# EAGLE design CHRONGLER (EAGLE 9.6.2)
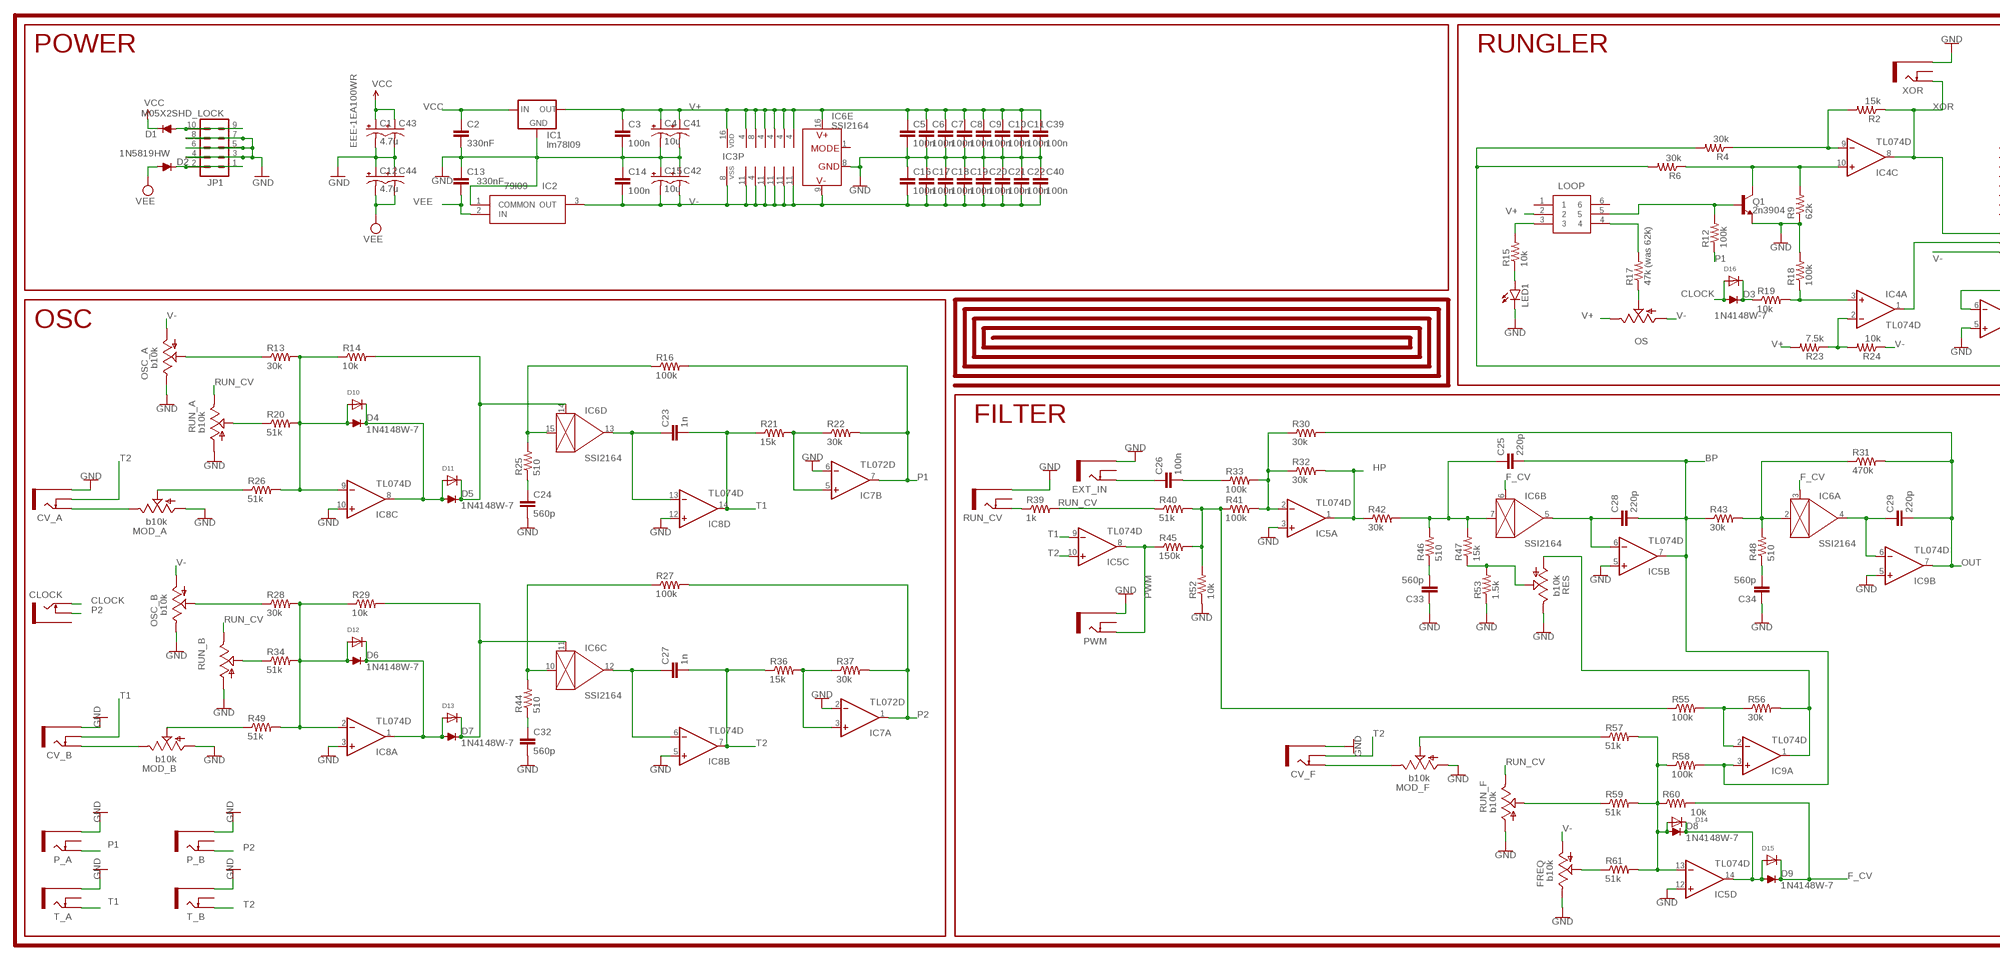
[diagram p0: schematic, sheet 1, part 1 of 2]
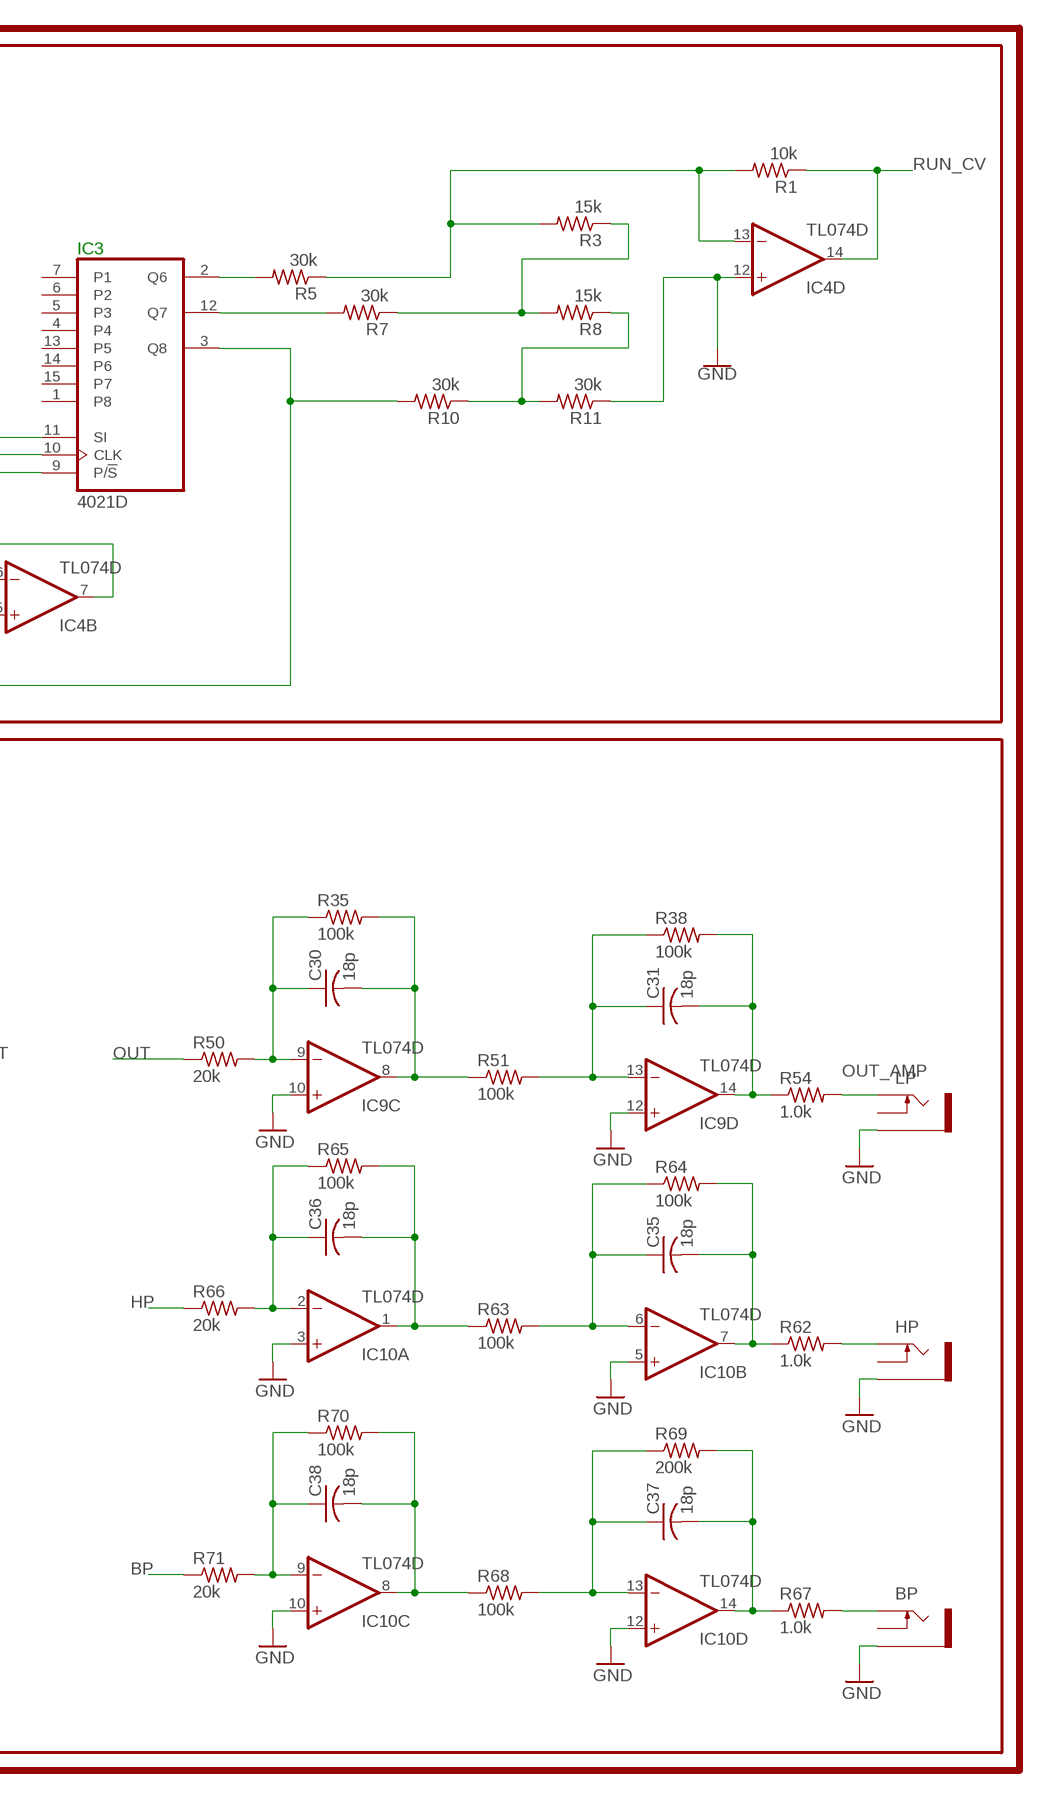
[diagram p1: schematic, sheet 1, part 2 of 2]

## Parts
BP  THONKICONNNEW  [WQP-PJ301M-12_JACK]
C1  4.7u  CPOL-USC  [PANASONIC_C]
C2  330nF  C-EUC1206  [C1206]
C3  100n  C-EUC1206  [C1206]
C4  10u  CPOL-USC  [PANASONIC_C]
C5  100n  C-EUC0603  [C0603]
C6  100n  C-EUC0603  [C0603]
C7  100n  C-EUC0603  [C0603]
C8  100n  C-EUC0603  [C0603]
C9  100n  C-EUC0603  [C0603]
C10  100n  C-EUC0603  [C0603]
C11  100n  C-EUC0603  [C0603]
C12  4.7u  CPOL-USC  [PANASONIC_C]
C13  330nF  C-EUC1206  [C1206]
C14  100n  C-EUC1206  [C1206]
C15  10u  CPOL-USC  [PANASONIC_C]
C16  100n  C-EUC0603  [C0603]
C17  100n  C-EUC0603  [C0603]
C18  100n  C-EUC0603  [C0603]
C19  100n  C-EUC0603  [C0603]
C20  100n  C-EUC0603  [C0603]
C21  100n  C-EUC0603  [C0603]
C22  100n  C-EUC0603  [C0603]
C23  1n  C-EUC0603  [C0603]
C24  560p  C-EUC0603  [C0603]
C25  220p  C-EUC0603  [C0603]
C26  100n  C-EUC0603  [C0603]
C27  1n  C-EUC0603  [C0603]
C28  220p  C-EUC0603  [C0603]
C29  220p  C-EUC0603  [C0603]
C30  18p  C-USC0603  [C0603]
C31  18p  C-USC0603  [C0603]
C32  560p  C-EUC0603  [C0603]
C33  560p  C-EUC0603  [C0603]
C34  560p  C-EUC0603  [C0603]
C35  18p  C-USC0603  [C0603]
C36  18p  C-USC0603  [C0603]
C37  18p  C-USC0603  [C0603]
C38  18p  C-USC0603  [C0603]
C39  100n  C-EUC0603  [C0603]
C40  100n  C-EUC0603  [C0603]
C41  CPOL-USE2.5-6  [E2,5-6]
C42  CPOL-USE2.5-6  [E2,5-6]
C43  CPOL-USE2.5-6  [E2,5-6]
C44  CPOL-USE2.5-6  [E2,5-6]
CLOCK  THONKICONNNEW  [WQP-PJ301M-12_JACK]
CV_A  THONKICONNNEW  [WQP-PJ301M-12_JACK]
CV_B  THONKICONNNEW  [WQP-PJ301M-12_JACK]
CV_F  THONKICONNNEW  [WQP-PJ301M-12_JACK]
D1  1N5819HW  DIODE-SOD123  [SOD123]
D2  1N5819HW  DIODE-SOD123  [SOD123]
D3  1N4148W-7  [SOD123]
D4  1N4148W-7  [SOD123]
D5  1N4148W-7  [SOD123]
D6  1N4148W-7  [SOD123]
D7  1N4148W-7  [SOD123]
D8  1N4148W-7  [SOD123]
D9  1N4148W-7  [SOD123]
D10  DIODESOD-323F  [SOD-323F]
D11  DIODESOD-323F  [SOD-323F]
D12  DIODESOD-323F  [SOD-323F]
D13  DIODESOD-323F  [SOD-323F]
D14  DIODESOD-323F  [SOD-323F]
D15  DIODESOD-323F  [SOD-323F]
D16  DIODESOD-323F  [SOD-323F]
EXT_IN  THONKICONNNEW  [WQP-PJ301M-12_JACK]
FREQ  b10k  9MM_SNAP-IN_POT_  [9MM_SNAP-IN_POT]
HP  THONKICONNNEW  [WQP-PJ301M-12_JACK]
IC1  lm78l09  78LXX-SOT89  [SOT89]
IC2  79l09  NJM79L05UA-TE1  [SOT-89-3]
IC3  4021D  [SO16]
IC4  TL074D  [SO14]
IC5  TL074D  [SO14]
IC6  SSI2164  SSM2164S  [SOIC16N]
IC7  TL072D  [SO08]
IC8  TL074D  [SO14]
IC9  TL074D  [SO14]
IC10  TL074D  [SO14]
JP1  M05X2SHD_LOCK  [2X5-SHROUDED_LOCK]
LED1  LEDLD260  [LD260]
LOOP  MHPS2266  [DIPS450W80P200L600H1050Q6N]
LP  THONKICONNNEW  [WQP-PJ301M-12_JACK]
MOD_A  b10k  9MM_SNAP-IN_POT_  [9MM_SNAP-IN_POT]
MOD_B  b10k  9MM_SNAP-IN_POT_  [9MM_SNAP-IN_POT]
MOD_F  b10k  9MM_SNAP-IN_POT_  [9MM_SNAP-IN_POT]
OS  9MM_SNAP-IN_POT_  [9MM_SNAP-IN_POT]
OSC_A  b10k  9MM_SNAP-IN_POT_  [9MM_SNAP-IN_POT]
OSC_B  b10k  9MM_SNAP-IN_POT_  [9MM_SNAP-IN_POT]
P_A  THONKICONNNEW  [WQP-PJ301M-12_JACK]
P_B  THONKICONNNEW  [WQP-PJ301M-12_JACK]
PWM  THONKICONNNEW  [WQP-PJ301M-12_JACK]
Q1  2n3904  TRANS_NPN-MMBT2222AL  [SOT23-3]
R1  10k  R-US_R0603  [R0603]
R2  15k  R-US_R0603  [R0603]
R3  15k  R-US_R0603  [R0603]
R4  30k  R-US_R0603  [R0603]
R5  30k  R-US_R0603  [R0603]
R6  30k  R-US_R0603  [R0603]
R7  30k  R-US_R0603  [R0603]
R8  15k  R-US_R0603  [R0603]
R9  62k  R-US_R0603  [R0603]
R10  30k  R-US_R0603  [R0603]
R11  30k  R-US_R0603  [R0603]
R12  100k  R-US_R0603  [R0603]
R13  30k  R-US_R0603  [R0603]
R14  10k  R-US_R0603  [R0603]
R15  10k  R-US_R0603  [R0603]
R16  100k  R-US_R0603  [R0603]
R17  47k (was 62k)  R-US_R0603  [R0603]
R18  100k  R-US_R0603  [R0603]
R19  10k  R-US_R0603  [R0603]
R20  51k  R-US_R0603  [R0603]
R21  15k  R-US_R0603  [R0603]
R22  30k  R-US_R0603  [R0603]
R23  7.5k  R-US_R0603  [R0603]
R24  10k  R-US_R0603  [R0603]
R25  510  R-US_R0603  [R0603]
R26  51k  R-US_R0603  [R0603]
R27  100k  R-US_R0603  [R0603]
R28  30k  R-US_R0603  [R0603]
R29  10k  R-US_R0603  [R0603]
R30  30k  R-US_R0603  [R0603]
R31  470k  R-US_R0603  [R0603]
R32  30k  R-US_R0603  [R0603]
R33  100k  R-US_R0603  [R0603]
R34  51k  R-US_R0603  [R0603]
R35  100k  R-US_R0603  [R0603]
R36  15k  R-US_R0603  [R0603]
R37  30k  R-US_R0603  [R0603]
R38  100k  R-US_R0603  [R0603]
R39  1k  R-US_R0603  [R0603]
R40  51k  R-US_R0603  [R0603]
R41  100k  R-US_R0603  [R0603]
R42  30k  R-US_R0603  [R0603]
R43  30k  R-US_R0603  [R0603]
R44  510  R-US_R0603  [R0603]
R45  150k  R-US_R0603  [R0603]
R46  510  R-US_R0603  [R0603]
R47  15k  R-US_R0603  [R0603]
R48  510  R-US_R0603  [R0603]
R49  51k  R-US_R0603  [R0603]
R50  20k  R-US_R0603  [R0603]
R51  100k  R-US_R0603  [R0603]
R52  10k  R-US_R0603  [R0603]
R53  1.5k  R-US_R0603  [R0603]
R54  1.0k  R-US_R0603  [R0603]
R55  100k  R-US_R0603  [R0603]
R56  30k  R-US_R0603  [R0603]
R57  51k  R-US_R0603  [R0603]
R58  100k  R-US_R0603  [R0603]
R59  51k  R-US_R0603  [R0603]
R60  10k  R-US_R0603  [R0603]
R61  51k  R-US_R0603  [R0603]
R62  1.0k  R-US_R0603  [R0603]
R63  100k  R-US_R0603  [R0603]
R64  100k  R-US_R0603  [R0603]
R65  100k  R-US_R0603  [R0603]
R66  20k  R-US_R0603  [R0603]
R67  1.0k  R-US_R0603  [R0603]
R68  100k  R-US_R0603  [R0603]
R69  200k  R-US_R0603  [R0603]
R70  100k  R-US_R0603  [R0603]
R71  20k  R-US_R0603  [R0603]
RES  b10k  9MM_SNAP-IN_POT_  [9MM_SNAP-IN_POT]
RUN_A  b10k  9MM_SNAP-IN_POT_  [9MM_SNAP-IN_POT]
RUN_B  9MM_SNAP-IN_POT_  [9MM_SNAP-IN_POT]
RUN_CV  THONKICONNNEW  [WQP-PJ301M-12_JACK]
RUN_F  b10k  9MM_SNAP-IN_POT_  [9MM_SNAP-IN_POT]
T_A  THONKICONNNEW  [WQP-PJ301M-12_JACK]
T_B  THONKICONNNEW  [WQP-PJ301M-12_JACK]
XOR  THONKICONNNEW  [WQP-PJ301M-12_JACK]

## Nets
BP: C25.2 C28.2 IC5.7(B:OUT) IC9.3(A:+IN) R43.1 R58.2 R71.1
CLOCK: CLOCK.P$1_TIP(TIP) D3.A D16.A
F_CV: D9.C D15.C IC6.3(A:CTRL) IC6.6(B:CTRL) R60.2
GND: BP.P$3_SLEEVE(SLEEVE) C1.- C2.2 C3.2 C4.- C5.2 C6.2 C7.2 C8.2 C9.2 C10.2 C11.2 C12.+ C13.1 C14.1 C15.+ C16.1 C17.1 C18.1 C19.1 C20.1 C21.1 C22.1 C24.2 C32.2 C33.1 C34.1 C39.2 C40.1 C41.- C42.+ C43.- C44.+ CV_A.P$3_SLEEVE(SLEEVE) CV_B.P$3_SLEEVE(SLEEVE) CV_F.P$3_SLEEVE(SLEEVE) EXT_IN.P$3_SLEEVE(SLEEVE) FREQ.3(E) HP.P$3_SLEEVE(SLEEVE) IC1.2(GND) IC1.2@1(GND) IC2.1(COMMON) IC4.5(B:+IN) IC4.12(D:+IN) IC5.3(A:+IN) IC5.5(B:+IN) IC5.12(D:+IN) IC6.8(E:GND) IC7.2(A:-IN) IC7.6(B:-IN) IC8.3(A:+IN) IC8.5(B:+IN) IC8.10(C:+IN) IC8.12(D:+IN) IC9.5(B:+IN) IC9.10(C:+IN) IC9.12(D:+IN) IC10.3(A:+IN) IC10.5(B:+IN) IC10.10(C:+IN) IC10.12(D:+IN) JP1.3 JP1.4 JP1.5 JP1.6 JP1.7 JP1.8 LED1.K(C) LP.P$3_SLEEVE(SLEEVE) MOD_A.1(A) MOD_B.1(A) MOD_F.1(A) OSC_A.3(E) OSC_B.3(E) P_A.P$3_SLEEVE(SLEEVE) P_B.P$3_SLEEVE(SLEEVE) PWM.P$3_SLEEVE(SLEEVE) Q1.2(E) R9.1 R11.1 R18.2 R52.1 R53.1 RES.3(E) RUN_A.1(A) RUN_B.1(A) RUN_CV.P$3_SLEEVE(SLEEVE) RUN_F.1(A) T_A.P$3_SLEEVE(SLEEVE) T_B.P$3_SLEEVE(SLEEVE) XOR.P$3_SLEEVE(SLEEVE)
HP: IC5.1(A:OUT) R32.2 R42.1 R66.1
N$1: CV_A.P$1_TIP(TIP) MOD_A.3(E)
N$2: CV_B.P$1_TIP(TIP) MOD_B.3(E)
N$3: MOD_A.2(S) R26.1
N$4: MOD_B.2(S) R49.1
N$5: D4.A D10.A IC8.9(C:-IN) R13.2 R14.1 R20.2 R26.2
N$6: D2.C JP1.1 JP1.2
N$7: D6.A D12.A IC8.2(A:-IN) R28.2 R29.1 R34.2 R49.2
N$8: R34.1 RUN_B.2(S)
N$9: OSC_B.2(S) R28.1
N$10: OSC_A.2(S) R13.1
N$11: R20.1 RUN_A.2(S)
N$12: D4.C D5.A D10.C D11.A IC8.8(C:OUT)
N$13: D7.C D13.C IC6.11(C:CTRL) R29.2
N$14: D6.C D7.A D12.C D13.A IC8.1(A:OUT)
N$15: D5.C D11.C IC6.14(D:CTRL) R14.2
N$16: FREQ.2(S) R61.1
N$17: C31.2 IC9.14(D:OUT) R38.2 R54.1
N$18: C32.1 R44.1
N$19: IC6.10(C:IN) R27.1 R44.2
N$20: D1.A JP1.9 JP1.10
N$21: IC6.15(D:IN) R16.1 R25.2
N$22: C24.1 R25.1
N$23: C27.1 IC6.12(C:OUT) IC8.6(B:-IN)
N$24: C23.1 IC6.13(D:OUT) IC8.13(D:-IN)
N$25: IC7.3(A:+IN) R36.2 R37.1
N$26: IC7.5(B:+IN) R21.2 R22.1
N$27: LOOP.4 R17.2
N$28: OS.2(S) R17.1
N$29: LOOP.5 Q1.1(B) R12.2
N$30: IC4.10(C:+IN) Q1.3(C) R6.1 R9.2
N$31: IC4.9(C:-IN) R2.2 R4.1
N$32: IC3.2(Q6) R5.2
N$33: IC3.12(Q7) R7.2
N$34: IC3.3(Q8) R4.2 R6.2 R10.2
N$35: R3.1 R7.1 R8.2
N$36: R8.1 R10.1 R11.2
N$37: IC4.13(D:-IN) R1.2 R3.2 R5.1
N$38: R40.2 R41.1 R45.2 R52.2 R55.1
N$39: C26.1 EXT_IN.P$1_TIP(TIP)
N$40: C26.2 R33.1
N$41: IC5.2(A:-IN) R30.1 R32.1 R33.2 R41.2
N$42: LED1.A R15.1
N$43: IC9.2(A:-IN) R55.2 R56.1
N$44: R47.1 R53.2 RES.2(S)
N$45: C33.2 R46.1
N$46: C25.1 IC6.7(B:IN) R42.2 R46.2 R47.2
N$47: C28.1 IC5.6(B:-IN) IC6.5(B:OUT)
N$48: IC4.6(B:-IN) IC4.7(B:OUT)
N$49: D8.A D14.A IC5.13(D:-IN) R57.2 R58.1 R59.2 R60.1 R61.2
N$50: C34.2 R48.1
N$51: IC6.2(A:IN) R31.1 R43.2 R48.2
N$52: C29.1 IC6.4(A:OUT) IC9.6(B:-IN)
N$53: IC9.1(A:OUT) R56.2 RES.1(A)
N$54: D8.C D9.A D14.C D15.A IC5.14(D:OUT)
N$55: IC4.3(A:+IN) R18.1 R19.2
N$56: R59.1 RUN_F.2(S)
N$57: CV_F.P$1_TIP(TIP) MOD_F.3(E)
N$58: MOD_F.2(S) R57.1
N$59: D3.C D16.C R19.1
N$60: C30.1 IC9.9(C:-IN) R35.1 R50.2
N$61: C31.1 IC9.13(D:-IN) R38.1 R51.2
N$62: C30.2 IC9.8(C:OUT) R35.2 R51.1
N$63: IC4.2(A:-IN) R23.1 R24.2
N$64: IC3.10(CLK) IC4.1(A:OUT)
N$65: R39.1 RUN_CV.P$1_TIP(TIP)
N$66: LOOP.3 R15.2
N$67: C35.1 IC10.6(B:-IN) R63.2 R64.1
N$68: C35.2 IC10.7(B:OUT) R62.1 R64.2
N$69: C36.1 IC10.2(A:-IN) R65.1 R66.2
N$70: C36.2 IC10.1(A:OUT) R63.1 R65.2
N$71: C37.1 IC10.13(D:-IN) R68.2 R69.1
N$72: C37.2 IC10.14(D:OUT) R67.1 R69.2
N$73: C38.1 IC10.9(C:-IN) R70.1 R71.2
N$74: C38.2 IC10.8(C:OUT) R68.1 R70.2
N$75: HP.P$1_TIP(TIP) R62.2
N$76: BP.P$1_TIP(TIP) R67.2
OUT: C29.2 IC9.7(B:OUT) R30.2 R31.2 R50.1
OUT_AMP: LP.P$1_TIP(TIP) R54.2
P1: IC7.7(B:OUT) P_A.P$1_TIP(TIP) R12.1 R16.2 R22.2
P2: CLOCK.P$2_SWITCH(SWITCH) IC7.1(A:OUT) P_B.P$1_TIP(TIP) R27.2 R37.2
PWM: IC5.8(C:OUT) PWM.P$1_TIP(TIP) R45.1
RUN_CV: IC4.14(D:OUT) R1.1 R39.2 R40.1 RUN_A.3(E) RUN_B.3(E) RUN_F.3(E)
T1: C23.2 CV_B.P$2_SWITCH(SWITCH) IC5.9(C:-IN) IC8.14(D:OUT) R21.1 T_A.P$1_TIP(TIP)
T2: C27.2 CV_A.P$2_SWITCH(SWITCH) CV_F.P$2_SWITCH(SWITCH) IC5.10(C:+IN) IC8.7(B:OUT) R36.1 T_B.P$1_TIP(TIP)
V+: C3.1 C4.+ C5.1 C6.1 C7.1 C8.1 C9.1 C10.1 C11.1 C39.1 C41.+ IC1.1(OUT) IC3.16(VDD) IC4.4(P:V+) IC5.4(P:V+) IC6.16(E:V+) IC7.8(P:V+) IC8.4(P:V+) IC9.4(P:V+) IC10.4(P:V+) LOOP.2 OS.3(E) R23.2
V-: C14.2 C15.- C16.2 C17.2 C18.2 C19.2 C20.2 C21.2 C22.2 C40.2 C42.- FREQ.1(A) IC2.3(OUT) IC3.8(VSS) IC3.9(P/!S) IC4.11(P:V-) IC5.11(P:V-) IC6.9(E:V-) IC7.4(P:V-) IC8.11(P:V-) IC9.11(P:V-) IC10.11(P:V-) OS.1(A) OSC_A.1(A) OSC_B.1(A) R24.1
VCC: C1.+ C2.1 C43.+ D1.C IC1.3(IN)
VEE: C12.- C13.2 C44.- D2.A IC2.2(IN)
XOR: IC3.11(SI) IC4.8(C:OUT) R2.1 XOR.P$1_TIP(TIP)
Unconnected: BP.P$2_SWITCH(SWITCH) CLOCK.P$3_SLEEVE(SLEEVE) EXT_IN.P$2_SWITCH(SWITCH) HP.P$2_SWITCH(SWITCH) IC3.1(P8) IC3.4 IC3.5(P3) IC3.6(P2) IC3.7(P1) IC3.13(P5) IC3.14(P6) IC3.15(P7) IC6.1(E:MODE) LOOP.1 LOOP.6 LP.P$2_SWITCH(SWITCH) P_A.P$2_SWITCH(SWITCH) P_B.P$2_SWITCH(SWITCH) PWM.P$2_SWITCH(SWITCH) RUN_CV.P$2_SWITCH(SWITCH) T_A.P$2_SWITCH(SWITCH) T_B.P$2_SWITCH(SWITCH) XOR.P$2_SWITCH(SWITCH)

## Notes on the sheet
- POWER | RUNGLER
- EEE-1EA100WR
- OSC
- FILTER

## Library data of the parts
BP CLOCK CV_A CV_B CV_F EXT_IN HP LP P_A P_B PWM RUN_CV T_A T_B XOR = MusicThingModular2:THONKICONN: 3.5mm socket for Eurorack modular synths
C1 C4 C12 C15 = rcl:CPOL-US: POLARIZED CAPACITOR, American symbol
C2 C3 C5-C11 C13 C14 C16-C29 C32-C34 C39 C40 = resistor:C-EU: CAPACITOR, European symbol
C30 C31 C35-C38 = rcl:C-US: CAPACITOR, American symbol
C41-C44 = adafruit:CPOL-US: POLARIZED CAPACITOR, American symbol
D1 D2 = diode:DIODE-: DIODE
D3-D9 = diode:1N4148: DIODE high speed (Philips)
D10-D16 = adafruit-DIODE:DIODE: Diode SMADIODE - SMA Surface Mount Package 20V 1A Schottky Diode Digikey: 641-1014-6-ND DO-1N4148 - Through Hole Small Current Diode SOD-123 20V 1 A (.5mV Vf) Schottky Diode - Digikey: MBRX120TPMSCT-ND SOD-323 10V 570mA (.38mV Vf, 3ns) Schottky Diode - Digikey: ZLLS410CT-ND SOD-523 30V 30mA Schottky Diode (RB751S-40TE61) - Digikey: RB751S-40TE61CT-ND SOT23-R/W - SOT23 Package (R = Solder Paste/Reflow Ovens, W = Hand-Soldering) BAT54Film 40V 300mA - Digikey: 497-7162-1-ND
FREQ MOD_A MOD_B MOD_F OS OSC_A OSC_B RES RUN_A RUN_B RUN_F = MusicThingModular:9MM_SNAP-IN_POT: 9mm vertical snap-in pot, Alpha / Panasonic style
IC1 = tsyklon-labs:78LXX: VOLTAGE REGULATOR
IC2 = NJM79L05UA-TE1:NJM79L05UA-TE1: Linear Voltage Regulators -5V .1A 3 Terminal Source: Datasheet <https://datasheet.datasheetarchive.com/originals/distributors/Datasheets-DGA25/1773862.pdf>; DESCRIPTION: Linear Voltage Regulators -5V .1A 3 Terminal; HEIGHT: mm; MANUFACTURER_NAME: New Japan Radio; MANUFACTURER_PART_NUMBER: NJM79L05UA-TE1; MOUSER_PART_NUMBER: 513-NJM79L05UA-TE1; MOUSER_PRICE-STOCK: https://www.mouser.co.uk/ProductDetail/NJR/NJM79L05UA-TE1?qs=YSrj7L49Q2vNpk5cHbz%2FyA%3D%3D
IC3 = 40xx:4021: 8-bit static SHIFT REGISTER
IC4 IC5 IC8-IC10 = linear:TL074: OP AMP
IC6 = ssm2164:SSM2164
IC7 = linear:TL072: OP AMP
JP1 = og-header:M05X2: Header 5x2 Standard 10-pin dual row 0.1" header. Commonly used with AVR-ISP. Use with Spark Fun Electronics SKU: PRT-00778
LED1 = led:LED: LED OSRAM: - CHIPLED LG R971, LG N971, LY N971, LG Q971, LY Q971, LO R971, LY R971 LH N974, LH R974 LS Q976, LO Q976, LY Q976 LO Q996 - Hyper CHIPLED LW Q18S LB Q993, LB Q99A, LB R99A - SideLED LS A670, LO A670, LY A670, LG A670, LP A670 LB A673, LV A673, LT A673, LW A673 LH A674 LY A675 LS A676, LA A676, LO A676, LY A676, LW A676 LS A679, LY A679, LG A679 - Hyper Micro SIDELED® LS Y876, LA Y876, LO Y876, LY Y876 LT Y87S - SmartLED LW L88C, LW L88S LB L89C, LB L89S, LG L890 LS L89K, LO L89K, LY L89K LS L896, LA L896, LO L896, LY L896 - TOPLED LS T670, LO T670, LY T670, LG T670, LP T670 LSG T670, LSP T670, LSY T670, LOP T670, LYG T670 LG T671, LOG T671, LSG T671 LB T673, LV T673, LT T673, LW T673 LH T674 LS T676, LA T676, LO T676, LY T676, LB T676, LH T676, LSB T676, LW T676 LB T67C, LV T67C, LT T67C, LS T67K, LO T67K, LY T67K, LW E67C LS E67B, LA E67B, LO E67B, LY E67B, LB E67C, LV E67C, LT E67C LW T67C LS T679, LY T679, LG T679 LS T770, LO T770, LY T770, LG T770, LP T770 LB T773, LV T773, LT T773, LW T773 LH T774 LS E675, LA E675, LY E675, LS T675 LS T776, LA T776, LO T776, LY T776, LB T776 LHGB T686 LT T68C, LB T68C - Hyper Mini TOPLED® LB M676 - Mini TOPLED Santana® LG M470 LS M47K, LO M47K, LY M47K Source: http://www.osram.convergy.de LUXEON: - LUMILED® LXK2-PW12-R00, LXK2-PW12-S00, LXK2-PW14-U00, LXK2-PW14-V00 LXK2-PM12-R00, LXK2-PM12-S00, LXK2-PM14-U00 LXK2-PE12-Q00, LXK2-PE12-R00, LXK2-PE12-S00, LXK2-PE14-T00, LXK2-PE14-U00 LXK2-PB12-K00, LXK2-PB12-L00, LXK2-PB12-M00, LXK2-PB14-N00, LXK2-PB14-P00, LXK2-PB14-Q00 LXK2-PR12-L00, LXK2-PR12-M00, LXK2-PR14-Q00, LXK2-PR14-R00 LXK2-PD12-Q00, LXK2-PD12-R00, LXK2-PD12-S00 LXK2-PH12-R00, LXK2-PH12-S00 LXK2-PL12-P00, LXK2-PL12-Q00, LXK2-PL12-R00 Source: www.luxeon.com KINGBRIGHT: KA-3528ASYC Source: www.kingbright.com
LOOP = DPDT PUSH ON OFF MHPS2266:MHPS2266: APEM - MHPS2266 - \u94A5\u5319\u5F00\u5173, DPDT, 100mA, 30VDC, PCB Source: Datasheet <http://www.mouser.com/ds/2/26/MHPS_Q42014-535293.pdf>; DESCRIPTION: APEM - MHPS2266 - \u94A5\u5319\u5F00\u5173, DPDT, 100mA, 30VDC, PCB; HEIGHT: 10.5mm; MANUFACTURER_NAME: Apem; MANUFACTURER_PART_NUMBER: MHPS2266; MOUSER_PART_NUMBER: 642-MHPS2266; MOUSER_PRICE-STOCK: https://www.mouser.co.uk/ProductDetail/Apem/MHPS2266?qs=%2Fs1LKTamv0yOhWIQlUyKbQ%3D%3D
Q1 = SparkFun-DiscreteSemi:TRANS_NPN: NPN transistor Current controlled devices typically used to amplify current or used as a switch. BC547 - COM-08928 <http://www.sparkfun.com/products/8928> (TO-92 45V 100mA) (1.Collector 2.Base 3.Emitter) 2N3904 - COM-00521 <http://www.sparkfun.com/products/521> (TO-92 40V 200mA) (1.Emitter 2.Base 3.Collector) P2N2222A - COM-12852 <http://www.sparkfun.com/products/12852> (TO-92 40V 600mA) (1.Collector 2.Base 3.Emitter); PROD_ID: TRANS-08049; VALUE: 600mA/40V
R1-R34 R36 R37 R39-R49 R52 R53 R55-R61 = resistor:R-US_: RESISTOR, American symbol
R35 R38 R50 R51 R54 R62-R71 = rcl:R-US_: RESISTOR, American symbol

## Board
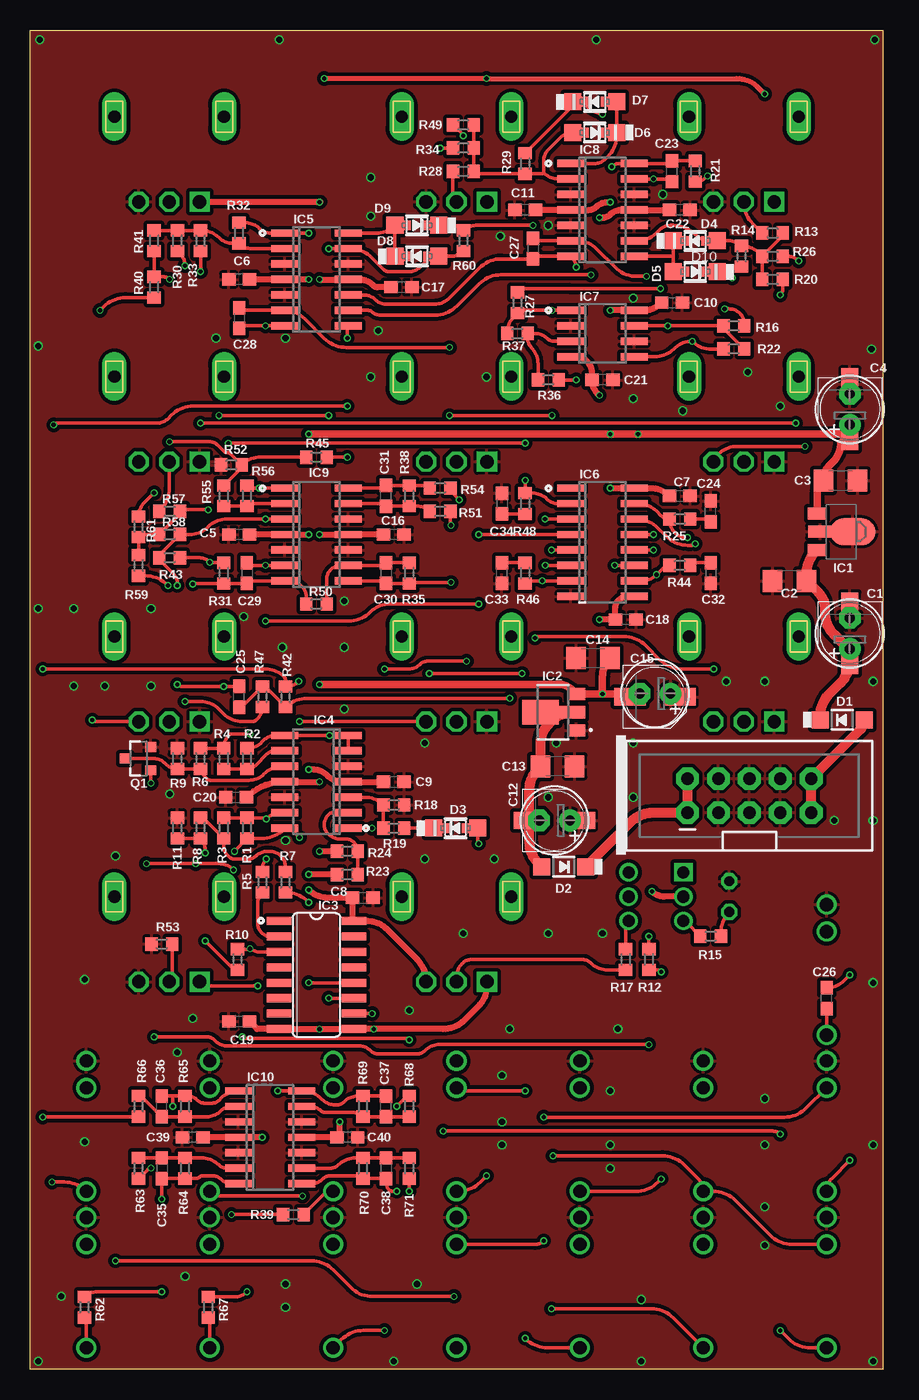
[diagram p2: board, top side]
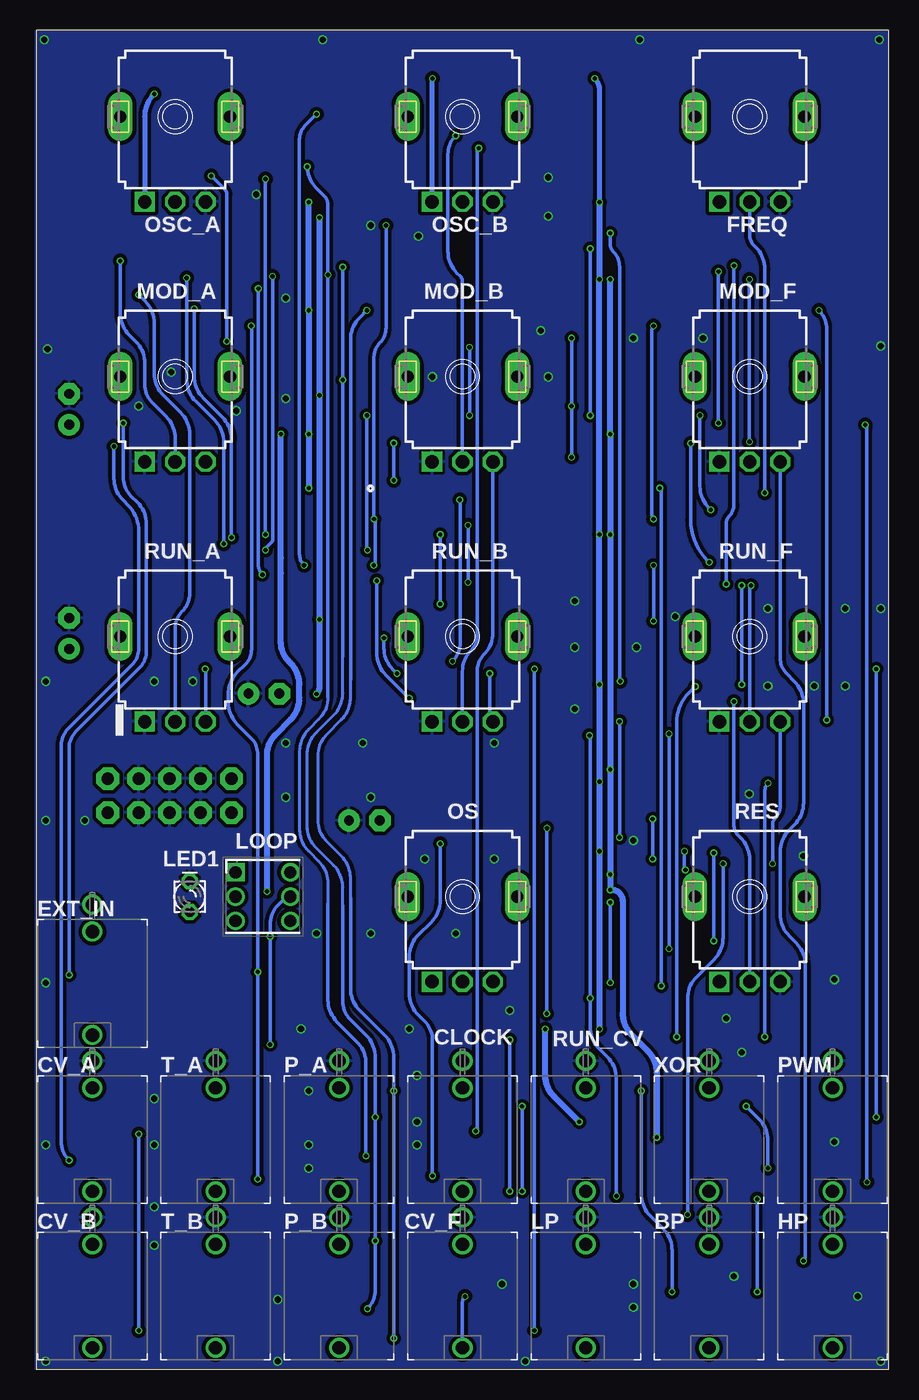
[diagram p3: board, bottom side, seen from below]

Size 70 x 110 mm. Coordinates in mm from the lower left corner, seen from the top.
Outline: 0,0 0,110 70,110 70,0 0,0
Copper layers (1*16): Top 0.035mm / dielectric 1.5mm / Bottom 0.035mm
Design rules "default *": minimum track width 6mil, minimum drill 0.35mm, track to track 6mil, track to pad 6mil, pad to pad 6mil, via to via 6mil, smd to smd 6mil, copper to edge 0mil, drill to drill 6mil, minimum pad ring 10mil, minimum via ring 0.1032mm, stop-mask expansion 4mil, vias tented up to drill 1mm, thermal gap 10mil

### Footprints (pad centres in the part's own frame; a part is rotated, then mirrored left to right if it is on the bottom)
WQP-PJ301M-12_JACK = drill 1.1: P$1_TIP 0,5; P$2_SWITCH 0,-3.5; P$3_SLEEVE 0,-5.715
PANASONIC_C = smd 2.6 x 1.4: + 2.05,0; - -2.05,0
C1206 = smd 1.6 x 1.8: 1 -1.4,0; 2 1.4,0
C0603 = smd 1.1 x 1: 1 -0.85,0; 2 0.85,0
E2,5-6 = drill 0.813 pad 1.778: + -1.27,0 | drill 0.813 pad 1.778 octagon: - 1.27,0
SOD123 = smd 1.4 x 1.4: A 1.805,0; C -1.805,0
SOD-323F = smd 1 x 0.8: A -1,0; C 1,0
9MM_SNAP-IN_POT = drill 1.1 square: 1 -2.5,-7 | drill 1.1 octagon: 2 0,-7; 3 2.5,-7 | drill 1 pad 2 long: CHASSIS1 -4.5,0; CHASSIS2 4.5,0
SOT89 = smd 1 x 1.5: 1 -1.499,-1.981; 3 1.499,-1.981 | smd 1 x 2: 2 0,-1.727 | smd 2.2 x 3.7: 2@1 0,0.94
SOT-89-3 = smd 1 x 1.5: 1 -1.5,-1.65; 3 1.5,-1.65 | smd 1 x 2.2: 2 0,-1.3 | smd 2 x 3: 4 0,1.3
SO16 = smd 0.66 x 2.032: 1 -4.445,-3.073; 2 -3.175,-3.073; 3 -1.905,-3.073; 4 -0.635,-3.073; 5 0.635,-3.073; 6 1.905,-3.073; 7 3.175,-3.073; 8 4.445,-3.073; 9 4.445,3.073; 10 3.175,3.073; 11 1.905,3.073; 12 0.635,3.073; 13 -0.635,3.073; 14 -1.905,3.073; 15 -3.175,3.073; 16 -4.445,3.073
SO14 = smd 0.6 x 2.2: 1 -3.81,-2.6; 2 -2.54,-2.6; 3 -1.27,-2.6; 4 0,-2.6; 5 1.27,-2.6; 6 2.54,-2.6; 7 3.81,-2.6; 8 3.81,2.6; 9 2.54,2.6; 10 1.27,2.6; 11 0,2.6; 12 -1.27,2.6; 13 -2.54,2.6; 14 -3.81,2.6
SOIC16N = smd 0.6 x 2.2: 1 -4.445,-2.6; 2 -3.175,-2.6; 3 -1.905,-2.6; 4 -0.635,-2.6; 5 0.635,-2.6; 6 1.905,-2.6; 7 3.175,-2.6; 8 4.445,-2.6; 9 4.445,2.6; 10 3.175,2.6; 11 1.905,2.6; 12 0.635,2.6; 13 -0.635,2.6; 14 -1.905,2.6; 15 -3.175,2.6; 16 -4.445,2.6
SO08 = smd 0.6 x 2.2: 1 -1.905,-2.6; 2 -0.635,-2.6; 3 0.635,-2.6; 4 1.905,-2.6; 5 1.905,2.6; 6 0.635,2.6; 7 -0.635,2.6; 8 -1.905,2.6
2X5-SHROUDED_LOCK = drill 1.016 pad 1.88 octagon: 1 -1.397,5.08; 2 1.397,5.08; 3 -1.397,2.54; 4 1.397,2.54; 5 -1.397,0; 6 1.397,0; 7 -1.397,-2.54; 8 1.397,-2.54; 9 -1.397,-5.08; 10 1.397,-5.08
LD260 = drill 0.813 octagon: A -1.27,0; K 1.27,0
DIPS450W80P200L600H1050Q6N = drill 1 pad 1.5 square: 1 -2.237,2.001 | drill 1 pad 1.5: 2 -2.237,0.001; 3 -2.237,-1.999; 4 2.263,-1.999; 5 2.263,0.001; 6 2.263,2.001
SOT23-3 = smd 0.8 x 0.9: 1 -0.95,-1; 2 0.95,-1; 3 0,1.1
R0603 = smd 1 x 1.1: 1 -0.85,0; 2 0.85,0

### Placement (x,y rotation side)
BP  14.73,6.75 180 bottom
C1  67.31,60.47 270 top
C2  62.36,64.77 180 top
C3  66.55,73.03 0 top
C4  67.31,78.89 270 top
C5  17.14,68.58 180 top
C6  17.14,89.53 180 top
C7  53.34,71.75 0 top
C8  27.3,38.73 0 top
C9  29.84,48.26 0 top
C10  52.7,87.63 0 top
C11  40.64,95.25 180 top
C12  43.03,45.09 0 top
C13  43.31,49.53 180 top
C14  46.23,58.42 0 top
C15  51.29,55.24 0 top
C16  29.84,68.58 180 top
C17  30.48,88.9 180 top
C18  48.9,61.59 180 top
C19  17.14,28.57 0 top
C20  16.89,46.99 0 top
C21  46.99,81.28 180 top
C22  53.34,95.25 180 top
C23  52.7,98.42 90 top
C24  55.88,70.48 90 top
C25  17.14,55.24 90 top
C26  65.41,30.48 90 top
C27  41.27,92.08 270 top
C28  17.14,86.36 270 top
C29  17.78,65.41 270 top
C30  29.21,65.41 270 top
C31  29.21,71.75 90 top
C32  55.88,65.41 270 top
C33  38.73,65.41 90 top
C34  38.73,71.12 270 top
C35  10.79,16.51 270 top
C36  10.79,21.59 90 top
C37  29.21,21.59 90 top
C38  29.21,16.51 270 top
C39  13.34,19.05 180 top
C40  26.04,19.05 180 top
C41  67.31,78.87 90 top
C42  51.31,55.5 180 top
C43  67.31,60.45 90 top
C44  43.05,45.09 180 top
CLOCK  35,19.61 180 bottom
CV_A  65.4,19.61 180 bottom
CV_B  65.4,6.75 180 bottom
CV_F  35,6.75 180 bottom
D1  66.67,53.34 0 top
D2  43.81,41.27 180 top
D3  34.92,44.45 0 top
D4  54.61,92.71 0 top
D5  54.61,90.17 180 top
D6  46.35,101.6 180 top
D7  46.35,104.14 0 top
D8  31.75,91.44 0 top
D9  31.75,93.98 180 top
D10  54.61,92.71 180 top
D11  54.61,90.17 0 top
D12  46.35,101.6 0 top
D13  46.35,104.14 180 top
D14  31.75,91.44 180 top
D15  31.75,93.98 0 top
D16  34.92,44.45 180 top
EXT_IN  65.4,32.45 180 bottom
FREQ  11.4,102.92 0 bottom
HP  4.6,6.75 180 bottom
IC1  66.6,68.81 270 top
IC2  43.18,53.98 90 top
IC3  23.5,32.38 270 top
IC4  23.5,48.26 90 top
IC5  23.5,89.53 270 top
IC6  46.99,67.94 270 top
IC7  46.99,85.09 270 top
IC8  46.99,95.25 270 top
IC9  23.5,68.58 270 top
IC10  19.68,19.05 270 top
JP1  59.05,47.12 90 top
LED1  57.4,38.82 90 bottom
LOOP  51.4,38.82 0 bottom
LP  24.87,6.75 180 bottom
MOD_A  58.6,81.56 0 bottom
MOD_B  35,81.56 0 bottom
MOD_F  11.4,81.56 0 bottom
OS  35,38.82 0 bottom
OSC_A  58.6,102.92 0 bottom
OSC_B  35,102.92 0 bottom
P_A  45.14,19.61 180 bottom
P_B  45.14,6.75 180 bottom
PWM  4.6,19.61 180 bottom
Q1  8.89,50.16 90 top
R1  17.78,44.45 90 top
R2  17.78,50.16 270 top
R3  15.88,44.45 90 top
R4  15.88,50.16 90 top
R5  19.05,40.01 270 top
R6  13.97,50.16 90 top
R7  20.95,40.01 270 top
R8  13.97,44.45 90 top
R9  12.06,50.16 270 top
R10  17.02,33.66 90 top
R11  12.06,44.45 270 top
R12  50.8,33.66 90 top
R13  60.96,93.34 0 top
R14  58.42,91.44 270 top
R15  55.88,35.56 180 top
R16  57.78,85.72 180 top
R17  48.9,33.66 90 top
R18  29.84,46.35 0 top
R19  29.84,44.45 180 top
R20  60.96,89.53 180 top
R21  54.61,98.42 270 top
R22  57.78,83.82 0 top
R23  26.04,40.64 180 top
R24  26.04,42.55 0 top
R25  53.34,69.85 180 top
R26  60.96,91.44 180 top
R27  40.01,87.63 270 top
R28  35.56,98.42 0 top
R29  40.64,99.06 90 top
R30  12.06,92.71 270 top
R31  15.88,65.41 270 top
R32  17.14,93.34 90 top
R33  13.97,92.71 90 top
R34  35.56,100.33 0 top
R35  31.11,65.41 270 top
R36  42.55,81.28 180 top
R37  40.01,85.09 180 top
R38  31.11,71.75 90 top
R39  21.59,12.7 180 top
R40  10.16,88.9 90 top
R41  10.16,92.71 90 top
R42  20.95,55.24 270 top
R43  11.43,66.67 0 top
R44  53.34,66.04 180 top
R45  23.5,74.93 180 top
R46  40.64,65.41 270 top
R47  19.05,55.24 90 top
R48  40.64,71.12 90 top
R49  35.56,102.23 0 top
R50  23.5,62.87 0 top
R51  33.66,70.48 180 top
R52  16.51,74.3 0 top
R53  10.79,34.92 0 top
R54  33.66,72.39 0 top
R55  15.88,71.75 270 top
R56  17.78,71.75 90 top
R57  11.43,70.48 0 top
R58  11.43,68.58 0 top
R59  8.89,66.04 90 top
R60  35.56,92.71 90 top
R61  8.89,69.22 270 top
R62  4.45,5.08 270 top
R63  8.89,16.51 90 top
R64  12.7,16.51 270 top
R65  12.7,21.59 90 top
R66  8.89,21.59 90 top
R67  14.61,5.08 270 top
R68  31.11,21.59 270 top
R69  27.3,21.59 90 top
R70  27.3,16.51 270 top
R71  31.11,16.51 90 top
RES  11.4,38.82 0 bottom
RUN_A  58.6,60.2 0 bottom
RUN_B  35,60.2 0 bottom
RUN_CV  24.87,19.61 180 bottom
RUN_F  11.4,60.2 0 bottom
T_A  55.27,19.61 180 bottom
T_B  55.27,6.75 180 bottom
XOR  14.73,19.61 180 bottom

### Tracks (layer width: path | path; a pad name or v marks a point on that pad's centre or on a via)
BP  (via drill 0.35)
  Top 0.305: IC5.7 v19.3,85.72 17.66,85.72 arc45 C28.2 | v12.06,64.39 12.06,64.67 arc45 11.81,65.28 10.7,66.39 arc-45 R43.1 arc-45 10.72,67.03 R58.2 13.07,68.58 arc45 14.61,69.22 arc-45 16.14,69.85 v19.3,69.85 IC9.3 | v12.06,56.26 arc45 12.47,56.09 v15.88,56.09 C25.2 | v31.11,14.61 R71.1 | v31.11,27.05 30.99,27.18 17.53,27.18 v17.4,27.3
  Bottom 0.305: v12.06,64.39 v12.06,56.26 | v15.88,56.09 16.4,55.57 arc-45 17.4,53.16 v17.4,27.3 | v19.3,69.85 arc45 19.43,70.16 19.43,85.42 arc45 v19.3,85.72 | v31.11,27.05 v31.11,14.61
CLOCK  (via drill 0.35)
  Top 0.305: v36.83,43.18 arc-45 36.73,43.42 D3.A D16.A | v37.47,15.88 36.94,15.35 arc-45 35.15,14.61 CLOCK.P$1_TIP
  Bottom 0.305: v36.83,43.18 36.83,38.52 arc45 37.57,36.72 38.63,35.67 arc-45 39.37,33.87 39.37,30.9 arc-45 38.63,29.1 38.1,28.57 arc45 37.47,27.04 v37.47,15.88
F_CV  (via drill 0.35)
  Top 0.305: IC6.3 v42.27,69.85 | v41.27,93.98 36.57,93.98 arc45 R60.2 arc45 34.55,93.98 D9.C D15.C | IC6.6 v42.29,66.04
  Bottom 0.305: v41.27,93.98 41.27,85.55 arc45 41.78,84.33 arc-45 42.27,83.16 v42.27,69.85 arc45 42.16,69.6 42.16,66.35 arc45 v42.29,66.04
GND  (via drill 0.5)
  other vias: 42.55,93.98 69.22,0.64 50.16,0.64 29.84,0.64 0.64,0.64 20.95,5.08 20.95,6.99 50.16,5.71 60.33,13.34 60.33,10.16 47.62,16.51 47.62,18.41 47.62,22.86 38.73,18.41 38.73,20.32 38.73,24.13 60.33,22.23 60.33,18.41 69.22,18.41 69.22,31.75 69.22,45.09 66.04,45.09 69.22,56.52 60.33,56.52 57.15,56.52 42.55,46.99 43.18,51.44 32.38,51.44 32.38,41.91 38.1,41.91 25.78,54.23 25.78,59.31 20.7,59.31 25.78,63.12 17.53,61.85 9.91,62.48 9.91,56.13 6.1,56.13 3.56,56.13 3.56,62.48 0.64,62.48 20.95,43.43 11.43,47.24 6.99,42.16 4.45,32 13.34,28.83 31.11,29.46 35.56,35.81 42.55,35.81 46.99,35.81 4.45,18.67 2.54,5.97 0.64,84.07 15.24,84.71 20.95,84.71 27.94,81.53 28.57,85.34 37.47,81.53 49.53,88.01 49.53,79.76 61.59,79.12 53.59,78.74 58.93,81.92 69.09,83.82 69.34,109.22 46.48,109.22 20.45,109.22 0.76,109.22 27.94,94.74 27.94,97.92 38.61,93.09 51.94,96.52 39.37,27.94 48.26,27.94 12.06,26.04 12.7,7.62 31.75,6.99 49.53,51.44 49.53,46.99
  pour Top (isolate 0.305): 0,0 70.1,0 70.1,109.98 0,109.98
  pour Bottom (isolate 0.305): 0,0 70.1,0 70.1,109.98 0,109.98
HP  (via drill 0.35)
  Top 0.305: R32.2 17.66,94.19 arc-45 18.8,93.73 arc45 19.72,93.34 IC5.1 v22.86,93.34 | v22.05,56.52 arc-45 21.03,56.09 R42.1 20.95,56.59 arc45 20.83,56.9 arc45 19.3,57.53 v1.02,57.53 | v1.02,20.7 arc-45 1.11,20.74 R66.1
  Bottom 0.305: v22.86,93.34 22.86,92.43 arc-45 22.61,91.82 arc45 22.1,90.59 22.1,56.56 v22.05,56.52 | v1.02,57.53 v1.02,20.7
N$1  (via drill 0.35)
  Top 0.305: CV_A.P$1_TIP arc-45 65.85,15.68 v67.31,17.14 | MOD_A.3 arc-45 56.25,74.92 56.52,75.18 arc-45 58.05,75.82 v63.63,75.82
  Bottom 0.305: v67.31,17.14 arc45 67.94,18.68 67.94,51.27 arc45 67.38,52.63 62.16,57.86 arc-45 61.59,59.21 61.59,68.87 arc-45 62.47,70.97 62.88,71.39 arc45 63.63,73.19 v63.63,75.82
N$2  (via drill 0.35)
  Top 0.305: v33.91,19.56 60.98,19.56 arc-45 v61.59,19.3 | v61.59,3.17 62.28,2.49 arc45 64.07,1.75 CV_B.P$1_TIP
  Bottom 0.305: MOD_B.3 32.5,60.5 arc45 33.24,58.7 33.27,58.67 arc-45 33.78,57.45 33.78,19.86 arc45 v33.91,19.56 | v61.59,19.3 v61.59,3.17
N$3  (via drill 0.35)
  Top 0.305: v63.12,91.06 arc45 62.2,91.44 R26.1
  Bottom 0.305: MOD_A.2 58.6,76.47 arc-45 59.34,78.27 60.45,79.38 arc45 61.09,80.91 61.09,82.64 arc-45 61.83,84.44 62.38,84.98 arc45 63.12,86.78 v63.12,91.06
N$4  (via drill 0.35)
  Top 0.305: v35.56,101.35 arc45 35.53,101.41 R49.1
  Bottom 0.305: MOD_B.2 35,89.36 arc-45 35.18,89.79 35.45,90.06 arc45 36.2,91.86 36.2,99.81 arc45 v35.56,101.35
N$5
  Top 0.305: R26.2 61.66,93 arc45 R13.2 | R26.2 59.85,91.7 arc45 R14.1 arc45 57.41,92.71 D4.A | R26.2 R20.2 | IC8.9 49.75,92.71 arc45 51.54,93.45 51.71,93.62 arc-45 52.58,93.98 52.8,93.98 arc-45 54.59,93.24 54.61,93.22 arc45 55.84,92.71 D4.A | D10.A D4.A
N$6
  Top 0.813: D2.C 49.32,44.98 arc-45 51.12,45.72 JP1.1 JP1.2
N$7
  Top 0.305: 42.16,98.3 42.16,99.28 arc-45 42.55,100.2 43.51,101.17 arc-45 D6.A D12.A | 42.16,98.3 arc-45 41.95,98.21 R29.1 36.93,98.21 arc-45 R28.2 R34.2 R49.2 | IC8.2 43.39,97.79 arc-45 42.16,98.3
N$8  (via drill 0.35)
  Top 0.305: R34.1 v33.66,100.33
  Bottom 0.305: v33.66,100.33 arc-45 33.78,100.02 33.78,60.28 arc45 34.29,59.05 arc-45 35,57.34 RUN_B.2
N$9
  Top 0.305: OSC_B.2 arc-45 34.71,96.62 R28.1
N$10
  Top 0.305: OSC_A.2 58.6,95.91 arc45 59.34,94.11 R13.1
N$11  (via drill 0.35)
  Top 0.305: R20.1 61.81,88.78 arc-45 v61.59,88.27
  Bottom 0.305: v61.59,88.27 61.07,87.74 arc45 60.33,85.94 60.33,81.82 arc-45 59.58,80.03 58.15,78.59 arc45 57.4,76.8 57.4,63.76 arc45 58.04,62.23 arc-45 58.6,60.88 RUN_A.2
N$12
  Top 0.305: 52.8,91.44 D5.A D11.A | 52.8,91.44 D4.C D10.C | IC8.8 52.8,91.44
N$13  (via drill 0.35)
  Top 0.305: v46.99,103.12 46.93,103.18 arc-45 45.87,103.62 D13.C D7.C | D7.C 44.62,104.14 | v48.01,66.04 IC6.11 | R29.2 44.32,103.59 arc45 D7.C
  Bottom 0.305: v46.99,103.12 47.91,102.2 arc-45 48.39,101.06 48.39,66.96 arc-45 v48.01,66.04
N$14
  Top 0.305: IC8.1 46.32,99.06 arc45 47.24,99.44 47.42,99.61 arc45 48.16,101.41 D6.C | D6.C D7.A D13.A | D6.C D12.C
N$15  (via drill 0.35)
  Top 0.305: 57.78,90.59 57.43,90.59 arc45 D5.C D11.C | 57.78,90.59 R14.2 | IC6.14 49.75,69.85 arc-45 51.54,69.11 52.22,68.44 arc45 54.01,67.69 54.3,67.69 arc45 v54.61,67.82 | v57.66,89.66 57.66,90.28 arc-45 57.78,90.59
  Bottom 0.305: v54.61,67.82 54.61,76.16 arc-45 55.35,77.96 56.91,79.52 arc45 57.66,81.32 v57.66,89.66
N$16  (via drill 0.35)
  Top 0.305: R61.1 arc-45 9.37,71.22 v10.16,72.01
  Bottom 0.305: v10.16,72.01 10.16,90.39 arc-45 10.9,92.18 11.05,92.33 arc45 11.4,93.18 FREQ.2
N$17
  Top 0.305: IC9.14 28.69,72.39 arc45 C31.2 R38.2 32.29,72.61 arc-45 R54.1
N$18
  Top 0.305: R44.1 arc-45 54.71,66.25 C32.1
N$19  (via drill 0.35)
  Top 0.305: v51.76,88.77 44.45,88.77 44.36,88.77 40.71,88.77 arc45 R27.1 | R44.2 arc45 51.99,65.83 v51.44,65.28 arc-45 50.21,64.77 IC6.10
  Bottom 0.305: v51.76,88.77 51.76,66.07 arc-45 v51.44,65.28
N$20
  Top 0.813: JP1.9 JP1.10 68.14,52.52 arc45 D1.A
N$21  (via drill 0.35)
  Top 0.305: IC6.15 49.9,71.12 arc-45 51.44,70.48 51.77,70.15 arc45 R25.2 52.49,69.84 arc45 52.96,68.71 arc45 53.88,68.33 v53.98,68.33 | v57.02,87.12 57.37,87.12 arc-45 58.29,86.74 arc-45 58.63,85.92 R16.1
  Bottom 0.305: v53.98,68.33 53.98,76.42 arc-45 54.72,78.21 56.28,79.77 arc45 57.02,81.57 v57.02,87.12
N$22
  Top 0.305: R25.1 55.36,69.85 arc-45 C24.1
N$23  (via drill 0.35)
  Top 0.305: v50.6,89.79 49.82,89.79 arc-45 48.02,90.53 46.48,92.08 arc45 44.95,92.71 IC8.6 41.79,92.71 arc-45 C27.1 | v51.18,67.31 IC6.12
  Bottom 0.305: v50.6,89.79 50.6,68.13 arc45 50.67,67.94 51.09,67.53 arc-45 v51.18,67.31
N$24  (via drill 0.35)
  Top 0.305: IC8.13 v51.18,97.79 52.19,97.79 arc-45 C23.1 | v51.18,68.58 IC6.13
  Bottom 0.305: v51.18,97.79 v51.18,68.58
N$25
  Top 0.305: IC7.3 43.03,84.45 arc-45 42.42,84.71 arc45 41.5,85.09 R37.1 40.85,84.65 arc45 41.15,83.95 arc-45 41.7,82.63 R36.2
N$26  (via drill 0.35)
  Top 0.305: R22.1 55.89,83.82 arc-45 v54.36,84.45 arc45 52.84,83.83 52.83,83.82 arc-45 51.3,83.19 IC7.5 | v55.63,98.04 55.54,97.96 arc-45 R21.2
  Bottom 0.305: v54.36,84.45 54.36,96.52 arc-45 54.54,96.95 v55.63,98.04
N$27
  Top 0.305: R17.2 48.9,36.24 arc-45 LOOP.4
N$28
  Top 0.305: OS.2 35,32.23 arc-45 35.43,33.27 35.55,33.39 arc-45 36.2,33.66 45.36,33.66 arc-45 45.97,33.4 arc45 47.41,32.8 R17.1
N$29  (via drill 0.35)
  Top 0.305: Q1.1 9.89,48.17 arc45 v9.91,48.13 | R12.2 v50.8,35.56 | v10.16,27.3 14.5,27.3 arc-45 15.11,27.05 15.22,26.94 arc45 16.18,26.54 27.02,26.54 arc-45 27.94,26.16 arc45 28.55,25.91 31.77,25.91 arc45 32.38,26.16 arc-45 33.61,26.67 v50.8,26.67
  Bottom 0.305: v9.91,48.13 arc-45 10.16,47.52 v10.16,27.3 | v50.8,26.67 v50.8,35.56 50.8,36.57 arc45 50.16,38.1 49.66,38.6 arc45 LOOP.5
N$30
  Top 0.305: IC4.10 20.71,49.53 arc45 19.18,48.9 arc-45 17.95,48.39 14.79,48.39 arc-45 14.48,48.51 14.18,48.81 arc-45 R6.1 R9.2 arc-45 11.13,49.7 11.05,49.78 arc45 10.13,50.16 Q1.3
N$31
  Top 0.305: IC4.9 20.04,50.8 arc45 19.43,50.55 18.5,49.61 arc-45 R2.2 R4.1
N$32
  Top 0.305: IC3.2 19.66,35.56 arc-45 19.05,35.81 18.94,35.93 arc-45 18.67,36.58 18.67,38.23 arc-45 R5.2
N$33  (via drill 0.35)
  Top 0.305: IC3.12 v22.86,31.75 | v22.86,38.35 22.8,38.41 arc45 21.01,39.16 R7.2
  Bottom 0.305: v22.86,31.75 v22.86,38.35
N$34  (via drill 0.35)
  Top 0.305: R10.2 17.94,34.51 v18.03,34.54 18.65,34.29 IC3.3 | v18.03,52.2 16.38,52.2 16.35,52.17 arc45 R4.2 R6.2
  Bottom 0.305: v18.03,52.2 v18.03,34.54
N$35
  Top 0.305: R8.2 arc-45 14.32,45.16 R3.1 15.88,42.9 arc45 16.13,42.29 16.33,42.09 arc45 16.76,41.91 17.93,41.91 arc45 18.54,42.16 18.56,42.19 arc-45 19.43,42.55 19.65,42.55 arc-45 20.57,42.16 arc-45 20.95,41.24 R7.1
N$36  (via drill 0.35)
  Top 0.305: R10.1 arc-45 16.52,33.01 v14.35,35.18 | v14.35,42.42 14.35,42.68 arc45 R8.1 R11.2
  Bottom 0.305: v14.35,35.18 v14.35,42.42
N$37  (via drill 0.35)
  Top 0.305: R3.2 R1.2 19.17,45.3 arc-45 v19.38,45.21 arc-45 20.61,45.72 IC4.13 | v19.38,41.91 arc45 19.05,41.12 R5.1
  Bottom 0.305: v19.38,45.21 v19.38,41.91
N$38  (via drill 0.35)
  Top 0.305: R41.1 R40.2 10.91,89.75 arc-45 v11.43,89.53 | R52.2 arc-45 18.89,74.93 R45.2 | R55.1 17.21,73.94 arc45 R52.2 | R52.2 16.5,75.16 arc45 16.13,75.31 arc-45 15.91,75.4 15.38,75.93 arc45 14.73,76.2 v11.43,76.2
  Bottom 0.305: v11.43,76.2 v11.43,89.53
N$39
  Top 0.305: C26.1 EXT_IN.P$1_TIP arc-45 EXT_IN.P$1_TIP
N$40  (via drill 0.35)
  Top 0.305: R33.1 v13.97,90.17 | v62.87,77.72 v13.97,77.72 | v67.31,32.38 66.86,31.93 arc-45 C26.2
  Bottom 0.305: v13.97,90.17 v13.97,77.72 | v62.87,77.72 62.87,73.29 arc-45 62.23,71.75 61.7,71.23 arc45 60.96,69.43 60.96,59.04 arc45 61.58,57.55 66.75,52.38 arc-45 67.31,51.02 v67.31,32.38
N$41
  Top 0.305: IC5.2 18.16,92.08 arc-45 R32.1 16.63,92.5 arc-45 15.49,92.96 arc45 14.05,93.56 R33.2 R30.1 R41.2
N$42
  Top 0.305: R15.1 56.73,35.93 arc-45 LED1.A
N$43
  Top 0.305: IC9.2 18.3,71.12 arc45 R56.1 R55.2
N$44  (via drill 0.35)
  Top 0.305: R53.2 11.64,32.41 arc-45 RES.2 | R47.1 arc-45 18.66,53.46 18.54,53.34 arc-45 18.23,53.21 17.4,53.21 arc-45 15.88,53.84 15.49,54.23 arc45 13.97,54.86 v12.7,54.86
  Bottom 0.305: v12.7,54.86 12.7,44.73 arc-45 12.32,43.81 12.14,43.64 arc45 11.4,41.84 RES.2
N$45
  Top 0.305: R46.1 C33.2
N$46  (via drill 0.35)
  Top 0.305: IC6.7 v42.04,64.77 41.16,64.77 arc45 R46.2 | C25.1 arc45 17.5,54.54 R47.2 arc-45 19.4,55.95 R42.2 arc-45 22.7,55.12 v39.37,55.12
  Bottom 0.305: v39.37,55.12 41.29,57.04 arc45 42.04,58.84 v42.04,64.77
N$47  (via drill 0.35)
  Top 0.305: C28.1 arc45 17.66,87 IC5.6 arc-45 22.52,86.32 24.15,84.69 arc45 25.94,83.95 v34.42,83.95 | v42.85,78.36 v34.42,78.36 | v42.8,67.31 IC6.5
  Bottom 0.305: v34.42,83.95 v34.42,78.36 | v42.85,78.36 42.85,67.36 v42.8,67.31
N$48
  Top 0.305: IC4.7 IC4.6
N$49  (via drill 0.35)
  Top 0.305: D8.A arc45 32.42,90.97 32,90.55 arc-45 31.08,90.17 29.46,90.17 arc-45 29.03,90.35 28.05,91.33 arc45 26.25,92.08 IC5.13 v24.51,92.08 | D8.A 34.55,91.44 arc45 R60.1 | v14.61,70.61 12.59,70.61 arc45 R57.2 arc-45 12.13,70.14 R58.1 9.41,68.58 arc45 R61.2 R59.2 | v15.49,78.36 v24.51,78.36 | D8.A D14.A
  Bottom 0.305: v14.61,70.61 14.75,70.76 arc45 15.49,72.55 v15.49,78.36 | v24.51,78.36 v24.51,92.08
N$50
  Top 0.305: C34.2 R48.1
N$51  (via drill 0.35)
  Top 0.305: IC6.2 43.34,71.12 arc-45 42.42,71.5 arc45 41.29,71.97 R48.2 v40.64,73.03 | v40.64,76.1 16.32,76.1 arc45 v16.26,76.07 | R31.1 arc45 15.78,66.29 v14.73,66.29 arc45 13.81,66.67 R43.2
  Bottom 0.305: v40.64,73.03 v40.64,76.1 | v16.26,76.07 16.26,69.77 arc-45 14.88,66.44 v14.73,66.29
N$52  (via drill 0.35)
  Top 0.305: IC9.6 v19.3,66.04 18.3,66.04 arc-45 C29.1 | IC6.4 v36.83,68.58 | v36.83,62.87 29.47,62.87 arc45 27.94,62.23 27.92,62.21 arc-45 26.13,61.47 v19.3,61.47
  Bottom 0.305: v36.83,68.58 v36.83,62.87 | v19.3,66.04 v19.3,61.47
N$53  (via drill 0.35)
  Top 0.305: IC9.1 v18.8,72.39 18.3,72.39 arc-45 R56.2 | RES.1 arc45 14.68,31.5 v18.67,31.5
  Bottom 0.305: v18.8,72.39 18.67,72.26 v18.67,31.5
N$54
  Top 0.305: IC5.14 28.41,93.34 arc45 D9.A | D9.A D8.C D14.C | D9.A D15.A
N$55
  Top 0.305: IC4.3 27.46,46.99 arc-45 R18.1 R19.2
N$56  (via drill 0.35)
  Top 0.305: v11.3,64.39 11.25,64.45 arc45 9.45,65.19 R59.1
  Bottom 0.305: RUN_F.2 11.4,64.16 arc45 v11.3,64.39
N$57  (via drill 0.35)
  Top 0.305: v6.99,8.89 23.08,8.89 arc-45 24.87,8.15 26.31,6.71 arc45 28.1,5.97 v34.8,5.97
  Bottom 0.305: MOD_F.3 8.9,58.4 arc-45 8.38,57.15 7.73,56.5 arc45 6.99,54.7 6.99,46.52 arc45 7.73,44.72 8.15,44.3 arc-45 8.89,42.51 8.89,37.37 arc-45 8.15,35.58 7.6,35.03 arc45 6.86,33.24 6.86,9.2 arc45 v6.99,8.89 | v34.8,5.97 arc-45 35,5.48 CV_F.P$1_TIP
N$58
  Top 0.305: MOD_F.2 11.4,72.36 arc-45 10.66,70.56 R57.1
N$59
  Top 0.305: R19.1 D3.C D16.C
N$60
  Top 0.305: R50.2 24.34,64.95 arc-45 24.64,65.66 arc-45 25.56,66.04 IC9.9 28.69,66.04 arc45 C30.1 R35.1
N$61
  Top 0.305: IC9.13 28.69,71.12 arc-45 C31.1 R38.1 31.79,70.91 arc-45 R51.2
N$62  (via drill 0.35)
  Top 0.305: IC9.8 28.69,64.77 arc-45 C30.2 R35.2 arc-45 31.33,64.64 v34.54,64.64 | R51.1 34.51,69.44 arc45 v34.54,69.34
  Bottom 0.305: v34.54,69.34 v34.54,64.64
N$63
  Top 0.305: IC4.2 24.82,45.72 arc45 24.51,45.59 24.49,45.57 arc45 24.13,44.7 arc45 24.4,44.05 24.51,43.94 arc45 25.43,43.56 25.93,43.56 arc-45 26.54,43.31 26.59,43.26 arc-45 R24.2 R23.1
N$64  (via drill 0.35)
  Top 0.305: IC3.10 v28.07,29.21 | v28.06,44.45 IC4.1
  Bottom 0.305: v28.07,29.21 v28.07,44.44 arc45 v28.06,44.45
N$65
  Top 0.305: RUN_CV.P$1_TIP arc45 23.98,14.24 R39.1
N$66
  Top 0.305: LOOP.3 arc-45 53.86,36.73 R15.2
N$67
  Top 0.305: IC10.6 16.11,16.51 arc-45 15.49,16.76 arc45 14.05,17.36 R64.1 C35.1 R63.2
N$68  (via drill 0.35)
  Top 0.305: IC10.7 16.54,15.24 arc-45 15.62,15.62 arc45 15.01,15.88 14.15,15.88 arc45 13.84,15.75 arc-45 13.63,15.66 R64.2 C35.2 v10.79,13.97 | R62.1 arc-45 5.46,6.35 v10.79,6.35
  Bottom 0.305: v10.79,6.35 v10.79,13.97
N$69
  Top 0.305: IC10.2 16.54,21.59 arc45 15.62,21.21 arc-45 14.49,20.74 R65.1 C36.1 arc-45 10.73,20.77 10.03,21.46 9.17,22.32 arc45 R66.2
N$70  (via drill 0.35)
  Top 0.305: IC10.1 arc45 15.67,22.27 15.49,22.1 arc-45 14.88,21.84 14.33,21.84 arc-45 13.72,22.1 arc45 12.89,22.44 R65.2 11.68,22.44 | 11.68,22.44 C36.2 | R63.1 9.62,16.39 arc-45 v9.91,16.51 | v11.68,21.59 11.68,22.44
  Bottom 0.305: v9.91,16.51 9.91,18.76 arc-45 10.65,20.56 v11.68,21.59
N$71
  Top 0.305: IC10.13 22.96,21.59 arc-45 23.88,21.21 arc45 24.18,21.08 26.48,21.08 arc-45 R69.1 C37.1 R68.2
N$72  (via drill 0.35)
  Top 0.305: C37.2 R69.2 26.91,22.44 arc45 25.78,21.97 arc-45 25.17,21.72 25.02,21.72 arc-45 23.93,22.17 23.88,22.23 arc45 22.34,22.86 IC10.14 v20.32,22.86 | v17.78,6.35 arc-45 16.77,5.93 R67.1
  Bottom 0.305: v20.32,22.86 20.32,14.39 arc-45 19.58,12.59 18.52,11.54 arc45 17.78,9.74 v17.78,6.35
N$73
  Top 0.305: IC10.9 24.66,16.51 arc45 25.27,16.76 arc-45 26.71,17.36 R70.1 C38.1 R71.2
N$74  (via drill 0.35)
  Top 0.305: IC10.8 23.08,15.24 arc45 24,15.62 arc-45 24.62,15.88 26.79,15.88 arc-45 R70.2 C38.2 29.21,15.35 arc45 29.46,14.73 arc45 29.77,14.61 v30.1,14.61 | v30.1,21.59 30.83,22.32 arc-45 R68.1
  Bottom 0.305: v30.1,14.61 v30.1,21.59
N$75
  Top 0.305: R62.2 arc-45 4.6,3.86 HP.P$1_TIP
N$76
  Top 0.305: R67.2 arc-45 14.73,3.92 BP.P$1_TIP
OUT  (via drill 0.35)
  Top 0.305: R50.1 22.64,63.55 arc45 22.35,64.26 arc45 21.13,64.77 IC9.7 18.3,64.77 arc45 C29.2 R31.2 13.43,64.56 arc45 v13.34,64.52 | v12.7,90.68 arc45 12.31,91.61 R30.2
  Bottom 0.305: v13.34,64.52 13.34,69.49 arc45 13.08,70.1 arc-45 12.7,71.02 v12.7,90.68
OUT_AMP  (via drill 0.35)
  Top 0.305: LP.P$1_TIP 25.55,2.43 arc-45 27.35,3.17 v29.08,3.17 | v29.08,57.53 31.08,57.53 arc45 32,57.91 arc-45 32.62,58.17 v35.81,58.17 | v35.23,71.42 34.68,71.97 arc-45 R54.2
  Bottom 0.305: v29.08,57.53 v29.08,3.17 | v35.81,58.17 arc-45 35.18,59.7 35.18,71.31 arc-45 v35.23,71.42
P1  (via drill 0.35)
  Top 0.305: IC7.7 v52.35,85.72 R16.2 arc45 57.08,85.38 R22.2 | R12.1 51.41,32.8 arc-45 v51.82,32.64 | v51.82,15.62 51.55,15.35 arc-45 49.75,14.61 P_A.P$1_TIP
  Bottom 0.305: v51.82,15.62 v51.82,32.64 51.82,50.52 arc-45 52.38,51.87 53.48,52.98 arc45 54.23,54.77 54.23,55.46 arc45 53.48,57.26 52.83,57.91 arc-45 52.32,59.14 52.32,85.67 arc-45 v52.35,85.72
P2  (via drill 0.35)
  Top 0.305: IC7.1 v42.85,87 40.52,87 arc45 R27.2 39.75,86.52 arc45 R37.2 | P_B.P$1_TIP 42.48,1.75 arc-45 40.69,2.49 v40.64,2.54 | v40.64,22.86 35.6,22.86 arc-45 CLOCK.P$2_SWITCH
  Bottom 0.254: 44.2,38.73 44.2,40.35 arc-45 44.94,42.15 46.12,43.33 arc45 46.86,45.12 46.86,50.38 arc45 46.12,52.18 44.94,53.36 arc-45 44.2,55.15 44.2,56.64
  Bottom 0.305: v40.64,2.54 v40.64,22.86 40.64,25.62 arc-45 41.38,27.41 43.45,29.48 arc45 44.2,31.28 44.2,38.73 | v42.85,87 43.45,86.39 arc-45 44.2,84.6 44.2,56.64
PWM  (via drill 0.35)
  Top 0.305: R45.1 v26.04,74.93 | v26.04,84.71 26.04,85.58 arc-45 IC5.8 | PWM.P$1_TIP 4.59,14.62 arc45 2.79,15.37 v1.78,15.37 | v1.91,77.6 arc-45 2.21,77.72 10.38,77.72 arc45 11.3,78.11 11.57,78.38 arc-45 13.37,79.12 v26.04,79.12
  Bottom 0.305: v26.04,74.93 v26.04,79.12 v26.04,84.71 | v1.78,15.37 1.78,77.29 arc-45 v1.91,77.6
RUN_CV  (via drill 0.35)
  Top 0.305: v16.76,42.55 arc-45 16.76,42.58 R1.1 18.99,43.6 arc45 20.79,44.34 IC4.14 arc-45 21.65,44.14 v22.1,43.69 | v16.69,41.02 arc45 15.46,41.53 v13.59,41.53 v9.53,41.53 | v22.1,53.21 32.47,53.21 arc-45 RUN_B.3 | v56.13,57.53 53.5,57.53 arc-45 51.71,58.27 50.53,59.45 arc45 48.73,60.2 41.76,60.2 arc45 v41.45,60.07 | v40.39,57.15 v32.77,57.15 | RUN_F.3 5.42,53.2 arc-45 v5.08,53.34 | v5.71,87 6.03,87.31 arc-45 7.82,88.05 R40.1 | v16.51,12.7 R39.2
  Bottom 0.305: RUN_F.3 8.9,46.23 arc45 9.27,45.34 arc-45 9.53,44.73 v9.53,41.53 | v16.76,42.55 16.76,41.2 arc45 v16.69,41.02 | v22.1,43.69 v22.1,53.21 | v13.59,41.53 13.59,35.47 arc45 14.33,33.67 15.77,32.24 arc-45 16.51,30.44 v16.51,12.7 | RUN_A.3 56.1,57.45 arc-45 v56.13,57.53 | v41.45,60.07 41.45,59.27 arc-45 40.71,57.47 v40.39,57.15 | v32.77,57.15 32.77,53.84 arc-45 RUN_B.3 | v5.08,53.34 5.08,85.46 arc-45 v5.71,87
T1  (via drill 0.35)
  Top 0.305: R21.1 C23.2 arc-45 52.19,99.06 IC8.14 48.37,99.06 arc45 v47.75,98.81 | IC5.9 27.76,87 arc-45 28.07,86.87 arc45 28.68,86.61 33.24,86.61 arc45 35.03,87.36 36.85,89.17 arc-45 38.64,89.92 v46.05,89.92 | v42.93,17.53 51.91,17.53 arc-45 53.7,16.78 54.84,15.64 arc-45 T_A.P$1_TIP 56.09,14.61 arc-45 57.89,13.87 60.76,10.99 arc45 62.56,10.25 CV_B.P$2_SWITCH
  Bottom 0.254: 46.05,55.24 46.05,55.2 arc45 46.8,53.41 47.64,52.56 arc-45 48.39,50.76 48.39,44.36 arc-45 47.64,42.56 46.8,41.72 arc45 46.05,39.92 46.05,38.23
  Bottom 0.305: v47.75,98.81 arc-45 47.03,97.07 46.35,96.39 arc45 46.05,95.66 v46.05,89.92 46.05,55.24 | 46.05,38.23 46.05,30.34 arc-45 45.31,28.54 43.67,26.91 arc45 42.93,25.11 v42.93,17.53
T2  (via drill 0.35)
  Top 0.305: v44.83,90.55 arc45 44.51,91.32 IC8.7 41.79,91.44 arc45 C27.2 38.68,91.22 arc45 36.89,90.48 34.42,88.01 arc-45 33.19,87.5 29.24,87.5 arc-45 28.32,87.88 arc45 27.4,88.27 IC5.10 | v44.83,81.28 R36.1 | v42.16,10.54 arc-45 41.46,10.25 CV_F.P$2_SWITCH | T_B.P$1_TIP 52.81,4.21 arc45 51.02,4.95 v42.8,4.95 | CV_A.P$2_SWITCH 63.74,21.45 arc-45 61.94,20.7 v42.16,20.7
  Bottom 0.254: 44.83,38.1 44.83,39.59 arc-45 45.58,41.38 47.01,42.82 arc45 47.75,44.61 47.75,50.51 arc45 47.01,52.31 45.58,53.74 arc-45 44.83,55.53 44.83,58.55
  Bottom 0.305: v44.83,90.55 v44.83,81.28 44.83,58.55 | 44.83,38.1 44.83,30.23 arc-45 44.2,28.7 42.91,27.41 arc45 42.16,25.62 v42.16,20.7 v42.16,10.54 42.16,6.49 arc45 v42.8,4.95
V+  (via drill 0.35)
  Top 0.305: C4.+ C41.+
  Top 0.508: v22.86,89.53 IC5.4 C6.1 | v47.62,87 IC7.8 50.32,87 arc45 C10.1 | v47.62,72.39 IC6.16 50.96,72.39 arc-45 C7.1 | v47.62,95.89 47.4,95.89 arc45 46.48,95.5 arc-45 45.87,95.25 IC8.4 C11.1 | v22.86,49.28 23.16,49.28 arc-45 24.38,48.77 arc45 25.61,48.26 IC4.4 C9.1 | v22.86,39.37 arc45 24.39,38.73 C8.1 26.45,37.1 arc45 IC3.16 27.68,36.83 arc-45 29.21,36.2 31.76,33.65 arc-45 32.5,31.85 OS.3 | R23.2 v22.86,40.64 | C5.1 IC9.4 v22.86,68.58 | LOOP.2 52.07,38.82 arc-45 v51.05,39.24 | v19.05,19.05 IC10.4 C39.1
  Top 0.61: IC1.1 64.62,71.75 arc-45 C3.1 arc-45 65.68,74.32 65.93,74.57 arc45 66.56,76.08 C4.+ v49.91,76.83 v47.62,76.83 v22.86,76.83
  Bottom 0.508: v22.86,89.53 v22.86,76.83 v22.86,68.58 v22.86,49.28 v22.86,40.64 v22.86,39.37 22.71,39.37 arc45 22.1,39.12 arc45 21.84,38.5 21.84,29.25 arc-45 21.1,27.45 19.79,26.14 arc45 19.05,24.35 v19.05,19.05 | v47.62,72.39 v47.62,76.83 v47.62,87 v47.62,95.89 | v51.05,39.24 51.05,49.53 51.05,50.38 arc45 50.31,52.18 49.13,53.36 arc-45 48.39,55.15 48.39,56.23 arc-45 49.13,58.02 49.28,58.17 arc45 49.91,59.7 49.91,66.67 | 49.91,65.38 49.91,66.67 | 49.91,66.67 v49.91,76.83
V-  (via drill 0.35)
  Top 0.305: C15.- arc-45 49.85,55.5 C42.-
  Top 0.406: v24.13,106.05 v37.47,106.05 58,106.05 arc-45 59.8,105.3 v60.33,104.78
  Top 0.508: v46.74,80.01 46.62,80.13 arc-45 C21.2 46.14,81.79 arc45 45.72,82.8 arc45 44.8,83.19 IC7.4 | v46.74,94.61 47.01,94.61 arc45 47.62,94.87 arc-45 48.55,95.25 IC8.11 C22.2 | R24.1 v23.75,42.55 | C20.2 arc-45 20.81,48.26 IC4.11 v23.75,48.26 | v23.75,68.58 IC9.11 C16.2 | v23.75,89.53 IC5.11 26.97,89.53 arc-45 28.19,89.03 arc45 28.5,88.9 C17.2 | 23.84,95.92 arc45 v23.75,95.89 arc45 23.66,95.92 FREQ.1 | v46.74,61.59 C18.2 48.05,62.6 arc-45 48.26,63.12 arc-45 49.18,63.5 IC6.9 | OS.1 37.5,31.57 arc-45 36.76,29.77 35.67,28.68 arc-45 33.87,27.94 v28.19,27.94 IC3.9 v23.75,27.94 IC3.8 18.63,27.94 C19.2 | v25.4,20.32 25.4,19.57 arc-45 C40.2 IC10.11
  Top 0.61: v46.99,55.48 IC2.3 44.48,55.83 arc45 43.43,56.26 v23.75,56.26 | v46.99,55.48 48.69,55.48 arc-45 C15.- | C14.2 arc45 46.99,56.89 v46.99,55.48
  Bottom 0.406: OSC_B.1 arc-45 37.47,96.01 v37.47,106.05 | v24.13,106.05 arc45 23.75,105.12 v23.75,95.89 | v60.33,104.78 60.36,104.74 arc-45 61.1,102.95 OSC_A.1
  Bottom 0.508: v46.99,55.48 arc-45 46.74,56.09 v46.74,61.59 v46.74,80.01 v46.74,94.61 | v23.75,27.94 v23.75,42.55 v23.75,48.26 v23.75,56.26 v23.75,68.58 v23.75,89.53 v23.75,95.89 | v25.4,20.32 27.45,22.37 arc45 28.19,24.17 v28.19,27.94
VCC
  Top 0.305: C1.+ C43.+
  Top 0.813: D1.C 64.87,53.66 arc-45 65.61,55.45 66.57,56.41 arc45 67.31,58.2 C1.+ arc45 66.86,59.5 66.02,60.34 arc-45 65.28,62.14 65.28,62.48 arc45 64.73,63.8 C2.1 63.76,65.4 arc-45 64.5,67.2 IC1.3
VEE
  Top 0.305: C12.- C44.-
  Top 0.813: D2.A 41.73,41.56 arc-45 40.98,43.35 C12.- 40.98,47.55 arc-45 41.73,49.35 C13.2 41.91,51.43 arc-45 42.55,52.96 42.91,53.33 arc-45 IC2.2
XOR  (via drill 0.35)
  Top 0.305: R2.1 arc45 19.01,51.53 19.18,51.69 arc-45 20.1,52.07 IC4.8 v24.56,52.07 | IC3.11 v24.51,30.48 | v22.35,14.22 15.66,14.22 arc-45 XOR.P$1_TIP
  Bottom 0.305: v24.56,52.07 arc45 24.51,51.94 v24.51,30.48 24.51,28.1 arc-45 23.77,26.31 23.1,25.64 arc45 22.35,23.84 v22.35,14.22